# Altium schematic sheet IO Extender.SchDoc
size 420 x 297 mm; SheetNumber: 4; SheetTotal: 7
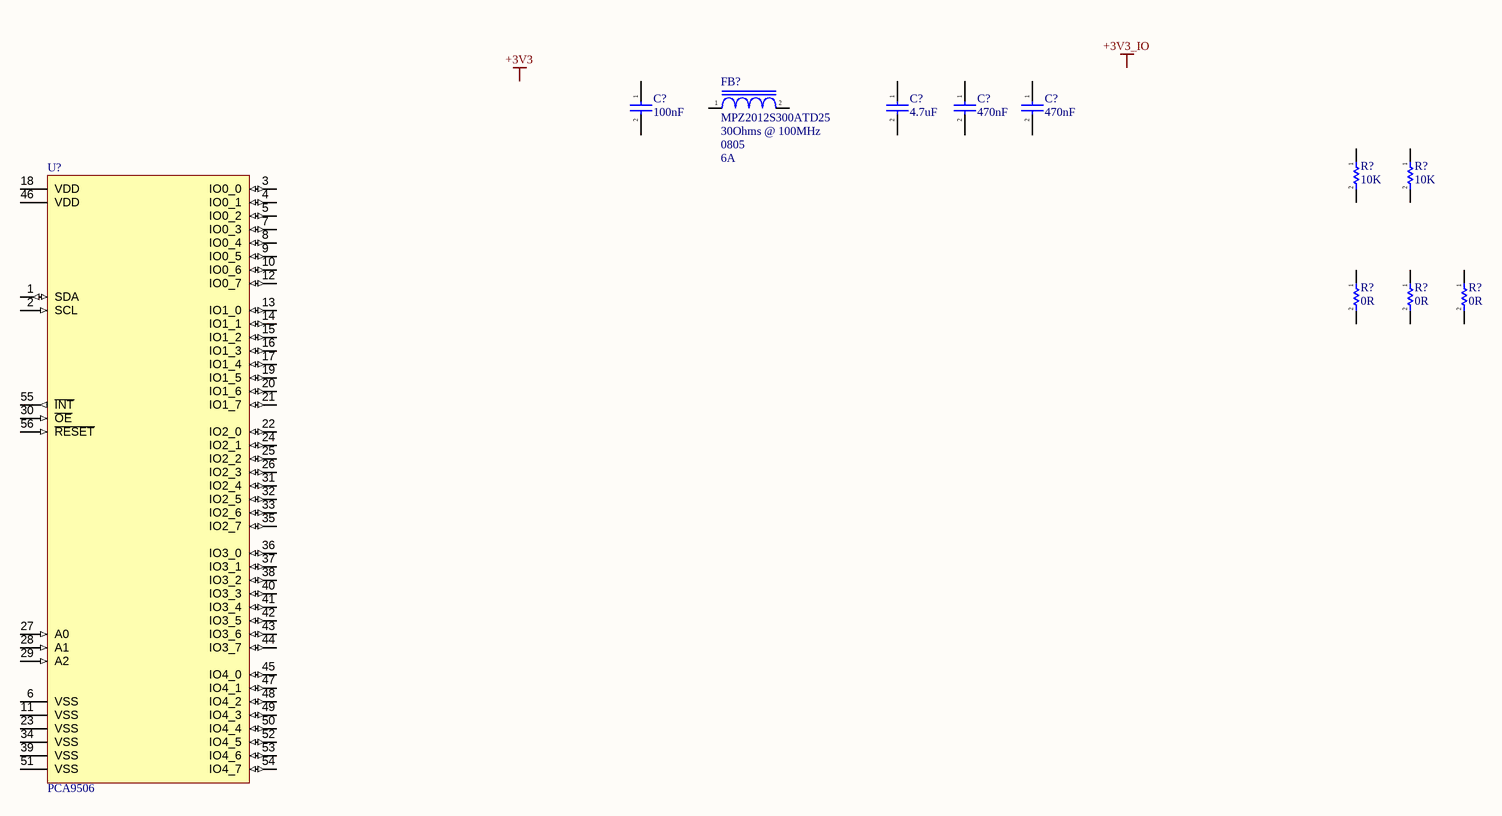
[diagram p0: IO Extender.SchDoc]

## Parts
(Parts that share a designator on the sheet are numbered #1, #2 ... from top to bottom, then left to right.)
C?#1  100nF  [CAP_0402]
C?#2  4.7uF  [CAP_0805]
C?#3  470nF  [CAP_0402]
C?#4  470nF  [CAP_0402]
FB?  MPZ2012S300ATD25  Impedance @ Freq: 30Ohms @ 100MHz  Package / Case: 0805  Current Rating: 6A  [IND_0805]
R?#1  10K  [RES_0603]
R?#2  10K  [RES_0603]
R?#3  0R  [RES_0603]
R?#4  0R  [RES_0603]
R?#5  0R  [RES_0603]
U?  PCA9506  [PCA9506]

## Nets

Not connected (* = marked no-connect by the designer): C?#1 1 2; C?#2 1 2; C?#3 1 2; C?#4 1 2; FB? 1 2; R?#1 1 2; R?#2 1 2; R?#3 1 2; R?#4 1 2; R?#5 1 2; U? 1(SDA) 2(SCL) 3(IO0_0) 4(IO0_1) 5(IO0_2) 6(VSS) 7(IO0_3) 8(IO0_4) 9(IO0_5) 10(IO0_6) 11(VSS) 12(IO0_7) 13(IO1_0) 14(IO1_1) 15(IO1_2) 16(IO1_3) 17(IO1_4) 18(VDD) 19(IO1_5) 20(IO1_6) 21(IO1_7) 22(IO2_0) 23(VSS) 24(IO2_1) 25(IO2_2) 26(IO2_3) 27(A0) 28(A1) 29(A2) 30(~{OE}) 31(IO2_4) 32(IO2_5) 33(IO2_6) 34(VSS) 35(IO2_7) 36(IO3_0) 37(IO3_1) 38(IO3_2) 39(VSS) 40(IO3_3) 41(IO3_4) 42(IO3_5) 43(IO3_6) 44(IO3_7) 45(IO4_0) 46(VDD) 47(IO4_1) 48(IO4_2) 49(IO4_3) 50(IO4_4) 51(VSS) 52(IO4_5) 53(IO4_6) 54(IO4_7) 55(~{INT}) 56(~{RESET})

## Notes on the sheet
- Labels drawn without touching a wire or pin: +3V3, +3V3_IO
- PROJECT
- TITLE
- FILE NAME
- A3
- SIZE
- DWG NO.
- SHEET
- OF
- REV

## Library data of the parts
C?#1-C?#4 = CAP_CER: Generic SMT Ceramic Capacitor; Voltage - Rated: 25V; Operating Temperature: *; Tolerance: *; Mfr: *; ComponentLink1Description: Digikey; ComponentLink1URL: [Digikey Link]; Digikey Part No: *; ComponentLink2Description: Datasheet; ComponentLink2URL: [Datasheet Link]
  C?#1 C?#3 C?#4: Footprint: 0402
  C?#2: Footprint: 0805
FB? = IND_MPZ2012S300ATD25: 30 Ohms @ 100 MHz 1 Power Line Ferrite Bead 0805 (2012 Metric) 6A 10mOhm; Resistance: 10mOhms; Operating Temperature: -55C - 125C; Rating: AEC-Q200
R?#1 R?#2 = RESISTOR: Power: 1/16W; Tolerance: 10%; Automotive: *; Operating Temperature: *; # Digikey: *; ComponentLink1Description: Digikey; ComponentLink1URL: *; # Manufacturer: *; Package / Case: 0603
R?#3-R?#5 = RESISTOR: Power: 1/8W; Tolerance: 10%; Automotive: *; Operating Temperature: *; Package / Case: 0603; # Digikey: *; ComponentLink1Description: Digikey; ComponentLink1URL: *; # Manufacturer: *
U? = IC_PCA9506: I/O Expander 40 pins I2C TSSOP-56; Mfr: NXP; Number of I/O: 40; Output Type: Push-Pull; Current Source: 10mA; Current Sink: 25mA; Clock: 400kHz; Voltage Supply: 2.3V - 5.5V; Operating Temperature: -40C to 85C; Supplier 1: Digi-Key; Supplier Part Number 1: 568-11940-1-ND; ComponentLink1Description: Digikey; ComponentLink1URL: https://www.digikey.ca/en/products/detail/nxp-usa-inc/PCA9506DGG-518/1157017; ComponentLink2Description: Datasheet; ComponentLink2URL: https://www.nxp.com/docs/en/data-sheet/PCA9505_9506.pdf